# EAGLE schematic S_M_v4.1_Board (EAGLE 8.2.0)
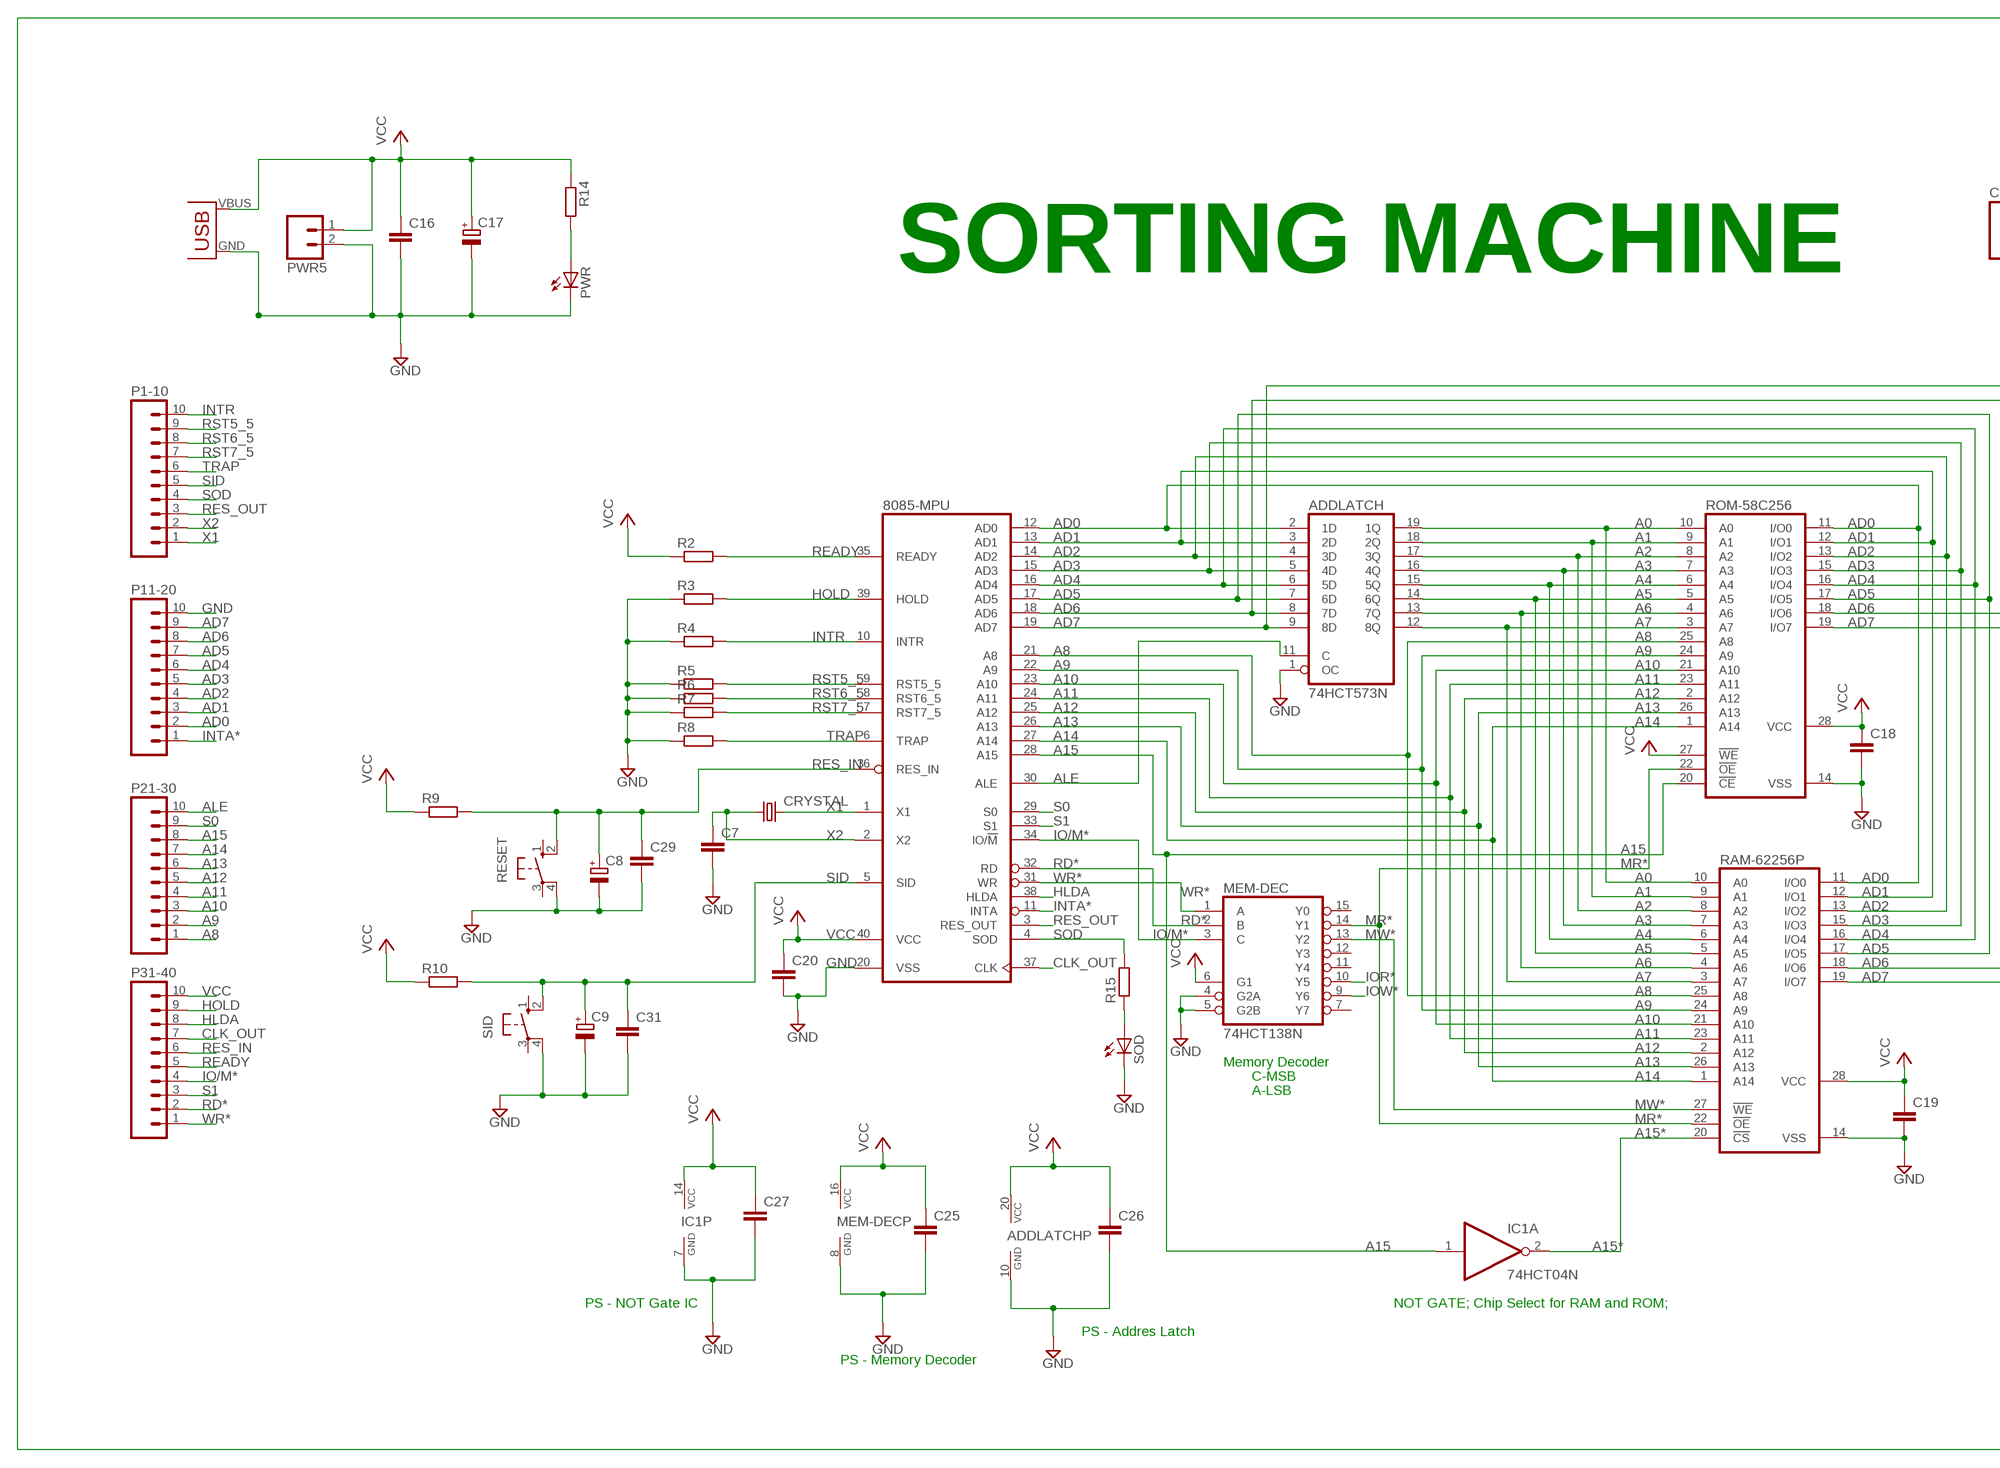
[diagram p0: schematic, sheet 1, part 1 of 2]
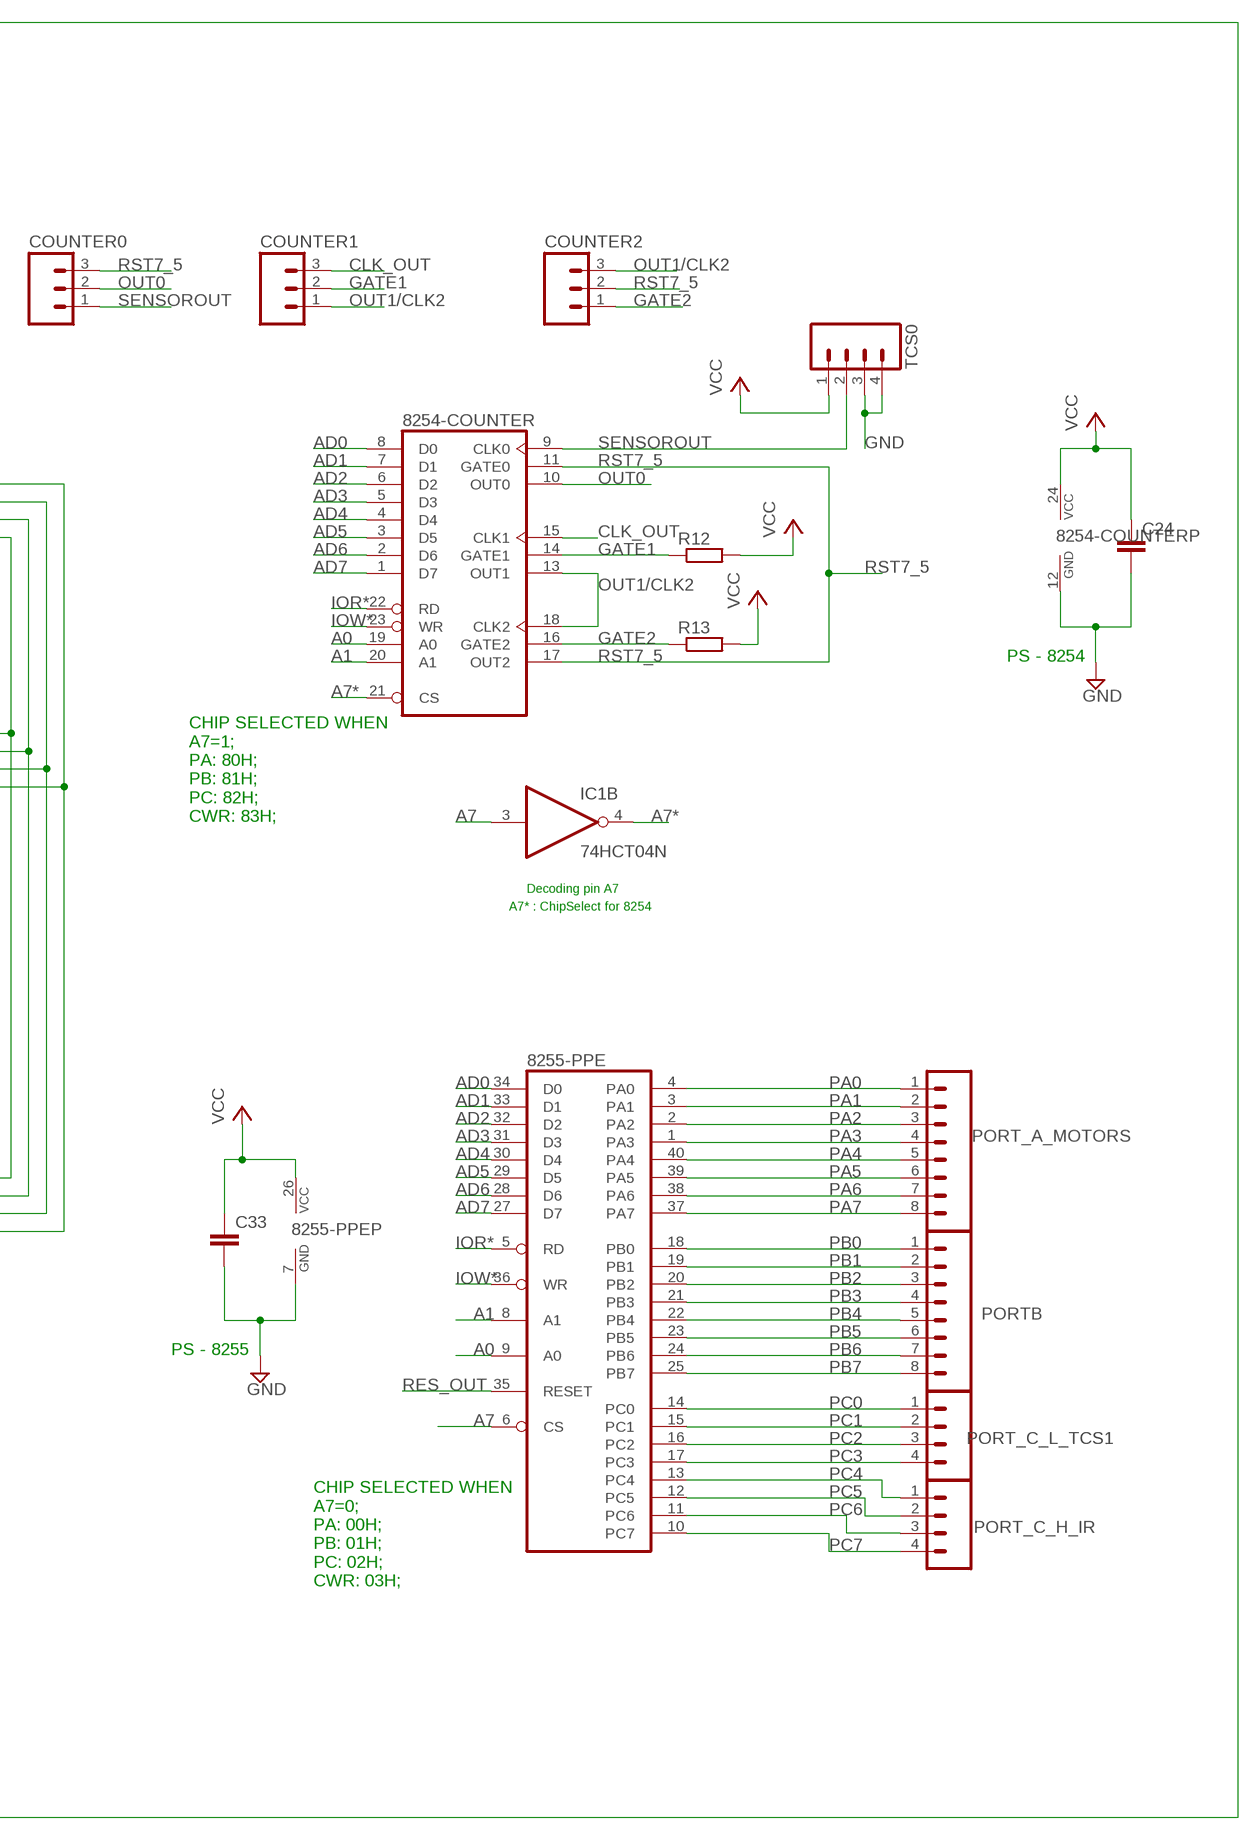
[diagram p1: schematic, sheet 1, part 2 of 2]

## Parts
8085-MPU  8085  [DIL40]
8254-COUNTER  8253  [DIL24-6]
8255-PPE  8255A  [DIL40]
ADDLATCH  74HCT573N  [DIL20]
C7  C-EU025-025X050  [C025-025X050]
C8  CPOL-EUE2.5-6  [E2,5-6]
C9  CPOL-EUE2.5-6  [E2,5-6]
C16  C-EU025-025X050  [C025-025X050]
C17  CPOL-EUE2.5-6  [E2,5-6]
C18  C-EU025-025X050  [C025-025X050]
C19  C-EU025-025X050  [C025-025X050]
C20  C-EU025-025X050  [C025-025X050]
C24  C-EU025-025X050  [C025-025X050]
C25  C-EU025-025X050  [C025-025X050]
C26  C-EU025-025X050  [C025-025X050]
C27  C-EU025-025X050  [C025-025X050]
C29  C-EU025-025X050  [C025-025X050]
C31  C-EU025-025X050  [C025-025X050]
C33  C-EU025-025X050  [C025-025X050]
COUNTER0  M03  [03P]
COUNTER1  M03  [03P]
COUNTER2  M03  [03P]
CRYSTAL  CRYSTALHC49US  [HC49US]
IC1  74HCT04N  [DIL14]
MEM-DEC  74HCT138N  [DIL16]
P1-10  M10  [10P]
P11-20  M10  [10P]
P21-30  M10  [10P]
P31-40  M10  [10P]
PORT_A_MOTORS  M08  [08P]
PORT_C_H_IR  M04  [04P]
PORT_C_L_TCS1  M04  [04P]
PORTB  M08  [08P]
PWR  LED5MM  [LED5MM]
PWR5  M02  [02P]
R2  R-EU_0204/7  [0204/7]
R3  R-EU_0204/7  [0204/7]
R4  R-EU_0204/7  [0204/7]
R5  R-EU_0204/7  [0204/7]
R6  R-EU_0204/7  [0204/7]
R7  R-EU_0204/7  [0204/7]
R8  R-EU_0204/7  [0204/7]
R9  R-EU_0204/7  [0204/7]
R10  R-EU_0204/7  [0204/7]
R12  R-EU_0204/7  [0204/7]
R13  R-EU_0204/7  [0204/7]
R14  R-EU_0204/7  [0204/7]
R15  R-EU_0204/7  [0204/7]
RAM-62256P  62256P  [DIL28-6]
RESET  10-XX  [B3F-10XX]
ROM-58C256  58C256P  [DIL28-6]
SID  10-XX  [B3F-10XX]
SOD  LED5MM  [LED5MM]
TCS0  M04  [04P]
USB  USB(POWER)  [USB(POWER)]

## Nets
A0: 8254-COUNTER.19(A0) 8255-PPE.9(A0) ADDLATCH.19(1Q) RAM-62256P.10(A0) ROM-58C256.10(A0)
A1: 8254-COUNTER.20(A1) 8255-PPE.8(A1) ADDLATCH.18(2Q) RAM-62256P.9(A1) ROM-58C256.9(A1)
A2: ADDLATCH.17(3Q) RAM-62256P.8(A2) ROM-58C256.8(A2)
A3: ADDLATCH.16(4Q) RAM-62256P.7(A3) ROM-58C256.7(A3)
A4: ADDLATCH.15(5Q) RAM-62256P.6(A4) ROM-58C256.6(A4)
A5: ADDLATCH.14(6Q) RAM-62256P.5(A5) ROM-58C256.5(A5)
A6: ADDLATCH.13(7Q) RAM-62256P.4(A6) ROM-58C256.4(A6)
A7: 8255-PPE.6(CS) ADDLATCH.12(8Q) IC1.3(B:I) RAM-62256P.3(A7) ROM-58C256.3(A7)
A7*: 8254-COUNTER.21(CS) IC1.4(B:O)
A8: 8085-MPU.21(A8) P21-30.1 RAM-62256P.25(A8) ROM-58C256.25(A8)
A9: 8085-MPU.22(A9) P21-30.2 RAM-62256P.24(A9) ROM-58C256.24(A9)
A10: 8085-MPU.23(A10) P21-30.3 RAM-62256P.21(A10) ROM-58C256.21(A10)
A11: 8085-MPU.24(A11) P21-30.4 RAM-62256P.23(A11) ROM-58C256.23(A11)
A12: 8085-MPU.25(A12) P21-30.5 RAM-62256P.2(A12) ROM-58C256.2(A12)
A13: 8085-MPU.26(A13) P21-30.6 RAM-62256P.26(A13) ROM-58C256.26(A13)
A14: 8085-MPU.27(A14) P21-30.7 RAM-62256P.1(A14) ROM-58C256.1(A14)
A15: 8085-MPU.28(A15) IC1.1(A:I) P21-30.8 ROM-58C256.20(!CE)
A15*: IC1.2(A:O) RAM-62256P.20(!CS)
AD0: 8085-MPU.12(AD0) 8254-COUNTER.8(D0) 8255-PPE.34(D0) ADDLATCH.2(1D) P11-20.2 RAM-62256P.11(I/O0) ROM-58C256.11(I/O0)
AD1: 8085-MPU.13(AD1) 8254-COUNTER.7(D1) 8255-PPE.33(D1) ADDLATCH.3(2D) P11-20.3 RAM-62256P.12(I/O1) ROM-58C256.12(I/O1)
AD2: 8085-MPU.14(AD2) 8254-COUNTER.6(D2) 8255-PPE.32(D2) ADDLATCH.4(3D) P11-20.4 RAM-62256P.13(I/O2) ROM-58C256.13(I/O2)
AD3: 8085-MPU.15(AD3) 8254-COUNTER.5(D3) 8255-PPE.31(D3) ADDLATCH.5(4D) P11-20.5 RAM-62256P.15(I/O3) ROM-58C256.15(I/O3)
AD4: 8085-MPU.16(AD4) 8254-COUNTER.4(D4) 8255-PPE.30(D4) ADDLATCH.6(5D) P11-20.6 RAM-62256P.16(I/O4) ROM-58C256.16(I/O4)
AD5: 8085-MPU.17(AD5) 8254-COUNTER.3(D5) 8255-PPE.29(D5) ADDLATCH.7(6D) P11-20.7 RAM-62256P.17(I/O5) ROM-58C256.17(I/O5)
AD6: 8085-MPU.18(AD6) 8254-COUNTER.2(D6) 8255-PPE.28(D6) ADDLATCH.8(7D) P11-20.8 RAM-62256P.18(I/O6) ROM-58C256.18(I/O6)
AD7: 8085-MPU.19(AD7) 8254-COUNTER.1(D7) 8255-PPE.27(D7) ADDLATCH.9(8D) P11-20.9 RAM-62256P.19(I/O7) ROM-58C256.19(I/O7)
ALE: 8085-MPU.30(ALE) ADDLATCH.11(C) P21-30.10
CLK_OUT: 8085-MPU.37(CLK) 8254-COUNTER.15(CLK1) COUNTER1.3 P31-40.7
GATE1: 8254-COUNTER.14(GATE1) COUNTER1.2 R12.1
GATE2: 8254-COUNTER.16(GATE2) COUNTER2.1 R13.1
GND [power1]: 8085-MPU.20(VSS) 8254-COUNTER.12(GND) 8255-PPE.7(GND) ADDLATCH.1(OC) ADDLATCH.10(GND) C7.2 C8.- C9.- C16.2 C17.- C18.2 C19.2 C20.2 C24.2 C25.2 C26.2 C27.2 C29.2 C31.2 C33.2 IC1.7(P:GND) MEM-DEC.4(G2A) MEM-DEC.5(G2B) MEM-DEC.8(GND) P11-20.10 PWR5.2 PWR.K(C) R3.1 R4.1 R5.1 R6.1 R7.1 R8.1 RAM-62256P.14(VSS) RESET.4(P1) ROM-58C256.14(VSS) SID.4(P1) SOD.K(C) TCS0.3 TCS0.4 USB.GND
HLDA: 8085-MPU.38(HLDA) P31-40.8
HOLD: 8085-MPU.39(HOLD) P31-40.9 R3.2
INTA*: 8085-MPU.11(INTA) P11-20.1
INTR: 8085-MPU.10(INTR) P1-10.10 R4.2
IO/M*: 8085-MPU.34(IO/!M) MEM-DEC.3(C) P31-40.4
IOR*: 8254-COUNTER.22(RD) 8255-PPE.5(RD) MEM-DEC.10(Y5)
IOW*: 8254-COUNTER.23(WR) 8255-PPE.36(WR) MEM-DEC.9(Y6)
MR*: MEM-DEC.14(Y1) RAM-62256P.22(!OE) ROM-58C256.22(!OE)
MW*: MEM-DEC.13(Y2) RAM-62256P.27(!WE)
N$25: R15.1 SOD.A
N$39: PWR.A R14.2
OUT0: 8254-COUNTER.10(OUT0) COUNTER0.2
OUT1/CLK2: 8254-COUNTER.13(OUT1) 8254-COUNTER.18(CLK2) COUNTER1.1 COUNTER2.3
PA0: 8255-PPE.4(PA0) PORT_A_MOTORS.1
PA1: 8255-PPE.3(PA1) PORT_A_MOTORS.2
PA2: 8255-PPE.2(PA2) PORT_A_MOTORS.3
PA3: 8255-PPE.1(PA3) PORT_A_MOTORS.4
PA4: 8255-PPE.40(PA4) PORT_A_MOTORS.5
PA5: 8255-PPE.39(PA5) PORT_A_MOTORS.6
PA6: 8255-PPE.38(PA6) PORT_A_MOTORS.7
PA7: 8255-PPE.37(PA7) PORT_A_MOTORS.8
PB0: 8255-PPE.18(PB0) PORTB.1
PB1: 8255-PPE.19(PB1) PORTB.2
PB2: 8255-PPE.20(PB2) PORTB.3
PB3: 8255-PPE.21(PB3) PORTB.4
PB4: 8255-PPE.22(PB4) PORTB.5
PB5: 8255-PPE.23(PB5) PORTB.6
PB6: 8255-PPE.24(PB6) PORTB.7
PB7: 8255-PPE.25(PB7) PORTB.8
PC0: 8255-PPE.14(PC0) PORT_C_L_TCS1.1
PC1: 8255-PPE.15(PC1) PORT_C_L_TCS1.2
PC2: 8255-PPE.16(PC2) PORT_C_L_TCS1.3
PC3: 8255-PPE.17(PC3) PORT_C_L_TCS1.4
PC4: 8255-PPE.13(PC4) PORT_C_H_IR.1
PC5: 8255-PPE.12(PC5) PORT_C_H_IR.2
PC6: 8255-PPE.11(PC6) PORT_C_H_IR.3
PC7: 8255-PPE.10(PC7) PORT_C_H_IR.4
RD*: 8085-MPU.32(RD) MEM-DEC.2(B) P31-40.2
READY: 8085-MPU.35(READY) P31-40.5 R2.2
RES_IN: 8085-MPU.36(RES_IN) C8.+ C29.1 P31-40.6 R9.2 RESET.2(S1)
RES_OUT: 8085-MPU.3(RES_OUT) 8255-PPE.35(RESET) P1-10.3
RST5_5: 8085-MPU.9(RST5_5) P1-10.9 R5.2
RST6_5: 8085-MPU.8(RST6_5) P1-10.8 R6.2
RST7_5: 8085-MPU.7(RST7_5) 8254-COUNTER.11(GATE0) 8254-COUNTER.17(OUT2) COUNTER0.3 COUNTER2.2 P1-10.7 R7.2
S0: 8085-MPU.29(S0) P21-30.9
S1: 8085-MPU.33(S1) P31-40.3
SENSOROUT: 8254-COUNTER.9(CLK0) COUNTER0.1 TCS0.2
SID: 8085-MPU.5(SID) C9.+ C31.1 P1-10.5 R10.2 SID.2(S1)
SOD: 8085-MPU.4(SOD) P1-10.4 R15.2
TRAP: 8085-MPU.6(TRAP) P1-10.6 R8.2
VCC [power1]: 8085-MPU.40(VCC) 8254-COUNTER.24(VCC) 8255-PPE.26(VCC) ADDLATCH.20(VCC) C16.1 C17.+ C18.1 C19.1 C20.1 C24.1 C25.1 C26.1 C27.1 C33.1 IC1.14(P:VCC) MEM-DEC.6(G1) MEM-DEC.16(VCC) P31-40.10 PWR5.1 R2.1 R9.1 R10.1 R12.2 R13.2 R14.1 RAM-62256P.28(VCC) ROM-58C256.27(!WE) ROM-58C256.28(VCC) TCS0.1 USB.VBUS(VCC)
WR*: 8085-MPU.31(WR) MEM-DEC.1(A) P31-40.1
X1: 8085-MPU.1(X1) CRYSTAL.2 P1-10.1
X2: 8085-MPU.2(X2) C7.1 CRYSTAL.1 P1-10.2
Unconnected: IC1.5(C:I) IC1.6(C:O) IC1.8(D:O) IC1.9(D:I) IC1.10(E:O) IC1.11(E:I) IC1.12(F:O) IC1.13(F:I) MEM-DEC.7(Y7) MEM-DEC.11(Y4) MEM-DEC.12(Y3) MEM-DEC.15(Y0) RESET.1(S) RESET.3(P) SID.1(S) SID.3(P)

## Notes on the sheet
- SORTING MACHINE
- PS - 8254
- CHIP SELECTED WHEN
  A7=1;
  PA: 80H;
  PB: 81H;
  PC: 82H;
  CWR: 83H;
- Decoding pin A7
- A7* : ChipSelect for 8254
- Memory Decoder
- C-MSB | PS - 8255
- A-LSB
- CHIP SELECTED WHEN
  A7=0;
  PA: 00H;
  PB: 01H;
  PC: 02H;
  CWR: 03H;
- PS - NOT Gate IC | NOT GATE; Chip Select for RAM and ROM;
- PS - Addres Latch
- PS - Memory Decoder

## Library data of the parts
8085-MPU = micro-intel:8085: MICROCOMPUTER/PERIPHERAL DEVICE; OC_FARNELL: unknown; OC_NEWARK: unknown
8254-COUNTER = micro-intel:8253: MICROCOMPUTER/PERIPHERAL DEVICE; OC_FARNELL: unknown; OC_NEWARK: unknown
8255-PPE = micro-intel:8255A: MICROCOMPUTER/PERIPHERAL DEVICE; OC_FARNELL: unknown; OC_NEWARK: unknown
ADDLATCH = 74xx-eu:74*573: 8-bit D latch BUS DRIVER
C7 C29 C31 C33 = rcl:C-EU: CAPACITOR, European symbol
C8 C9 C17 = rcl:CPOL-EU: POLARIZED CAPACITOR, European symbol
C16 C18-C20 C24-C27 = resistor:C-EU: CAPACITOR, European symbol
COUNTER0 COUNTER1 COUNTER2 = con-amp-quick:M03: AMP QUICK CONNECTOR; OC_FARNELL: unknown; OC_NEWARK: unknown
CRYSTAL = CEDT_JANUARY_2015_v5:CRYSTAL: Crystals Various standard crystals. Proven footprints. Spark Fun Electronics SKU : COM-00534
IC1 = 74xx-eu:74*04: Hex INVERTER
MEM-DEC = 74xx-eu:74*138: 3-line to 8-line DECODER/DEMULTIPLEXER
P1-10 P11-20 P21-30 P31-40 = con-amp-quick:M10: AMP QUICK CONNECTOR; OC_FARNELL: unknown; OC_NEWARK: unknown
PORT_A_MOTORS PORTB = con-amp-quick:M08: AMP QUICK CONNECTOR; OC_FARNELL: unknown; OC_NEWARK: unknown
PORT_C_H_IR PORT_C_L_TCS1 TCS0 = con-amp-quick:M04: AMP QUICK CONNECTOR; OC_FARNELL: unknown; OC_NEWARK: unknown
PWR SOD = CEDTv79:LED
PWR5 = CEDT_JANUARY_2015_v5:M02: AMP QUICK CONNECTOR
R2-R8 R12-R15 = rcl:R-EU_: RESISTOR, European symbol
R9 R10 = resistor:R-EU_: RESISTOR, European symbol
RAM-62256P = memory-hitachi:62256P: MEMORY; OC_FARNELL: unknown; OC_NEWARK: unknown
RESET SID = switch-omron:10-XX: OMRON SWITCH; MPN: B3F-1000; OC_FARNELL: 176432; OC_NEWARK: 36M3542
ROM-58C256 = memory-hitachi:58C256P: MEMORY; MPN: HN58C256AP85E; OC_FARNELL: 1496447; OC_NEWARK: 61M6616
USB = CEDT_JANUARY_2015_v5:USB(POWER)

## Net classes
0 default: width 0.356 mm, clearance 0.2 mm
1 power1: width 0.61 mm, clearance 0.2 mm
2 powermotor: width 0.762 mm, clearance 0.2 mm